# Altium schematic sheet RTC.SchDoc
size 420 x 297 mm; SheetNumber: 16; SheetTotal: 23
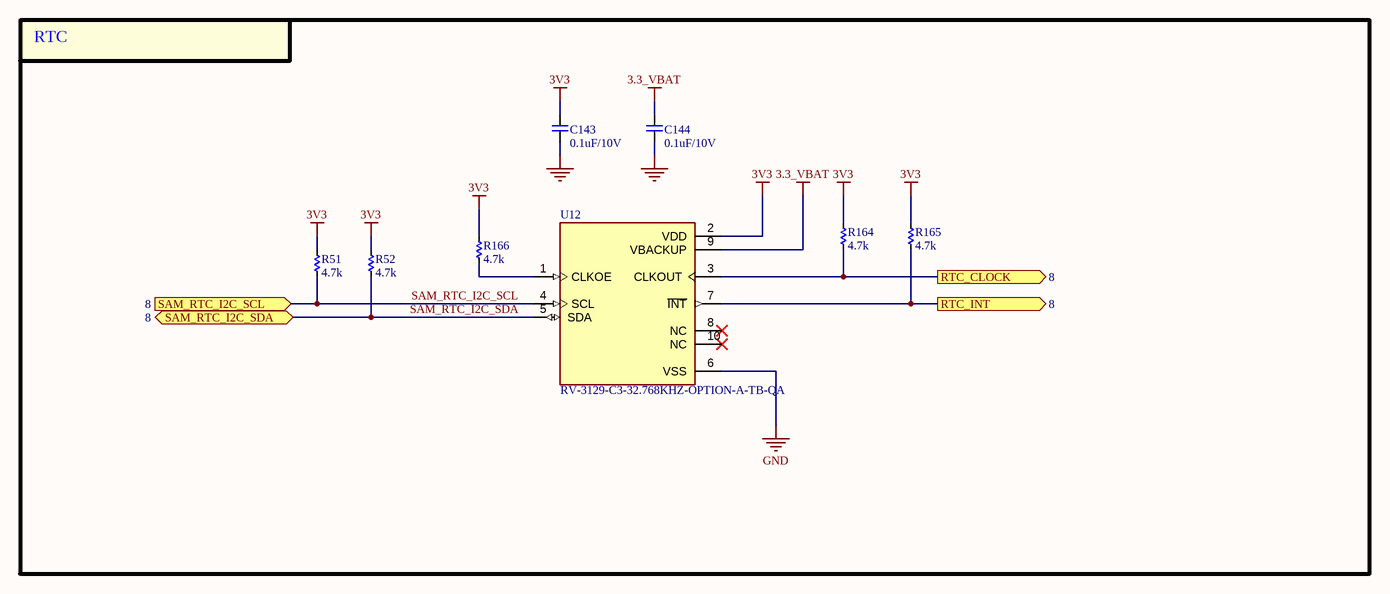
[diagram p0: RTC.SchDoc]

## Parts
C143  0.1uF/10V  [CAP_C_1005X50_L]
C144  0.1uF/10V  [CAP_C_1005X50_L]
R51  4.7k  [RES_C_1005x30_L]
R52  4.7k  [RES_C_1005x30_L]
R164  4.7k  [RES_C_1005x30_L]
R165  4.7k  [RES_C_1005x30_L]
R166  4.7k  [RES_C_1005x30_L]
U12  RV-3129-C3-32.768KHZ-OPTION-A-TB-QA  [IC_RV-3129-C3-32.768KHZ-OPTION-A-TB-QA]

## Blocks framed on the sheet
RTC: C143 C144 R51 R52 R164-R166 U12

## Ports
RTC_CLOCK (out, see 8), RTC_INT (out, see 8), SAM_RTC_I2C_SCL (in, see 8), SAM_RTC_I2C_SDA (bidir, see 8)

## Nets
3.3_VBAT: C144.2 U12.9(VBACKUP)
3V3: C143.2 R51.1 R52.1 R164.1 R165.1 R166.1 U12.2(VDD)
GND: C143.1 C144.1 U12.6(VSS)
RTC_CLOCK: R164.2 U12.3(CLKOUT) ; port RTC_CLOCK
RTC_INT: R165.2 U12.7(~{INT}) ; port RTC_INT
SAM_RTC_I2C_SCL: R51.2 U12.4(SCL) ; port SAM_RTC_I2C_SCL
SAM_RTC_I2C_SDA: R52.2 U12.5(SDA) ; port SAM_RTC_I2C_SDA
NetR166_2: R166.2 U12.1(CLKOE)

Not connected (* = marked no-connect by the designer): U12 8(NC)* 10(NC)*

## Notes on the sheet
- Project:
- BEE-1012
- Sub-system:
- SATELLITE_EXP_CONTROLLER
- Design by:
- SANG HUYNH
- BAO BUI
- Sheet title:
- Sheet
- A3
- of
- Checked by:
- Approved by:
- VU PHAM
- Revision:
- Document No:
- Size:
- Date:

## Library data of the parts
C143 C144 = _CAP_C_2: CAP CHIP
R51 R52 R164-R166 = _RES_B_2: RES
U12 = RV-3129-C3-32.768KHZ-OPTION-A-TB-QA: Real-Time Clock Module with I2C-Bus; MP: RV-3129-C3-32.768KHZ-OPTION-A-TB-QA; Value: *; Price: None; Package: None; Availability: Unavailable